# Altium schematic sheet Schematic_Scout2Map_Altium.schdoc
size 321 x 215 mm
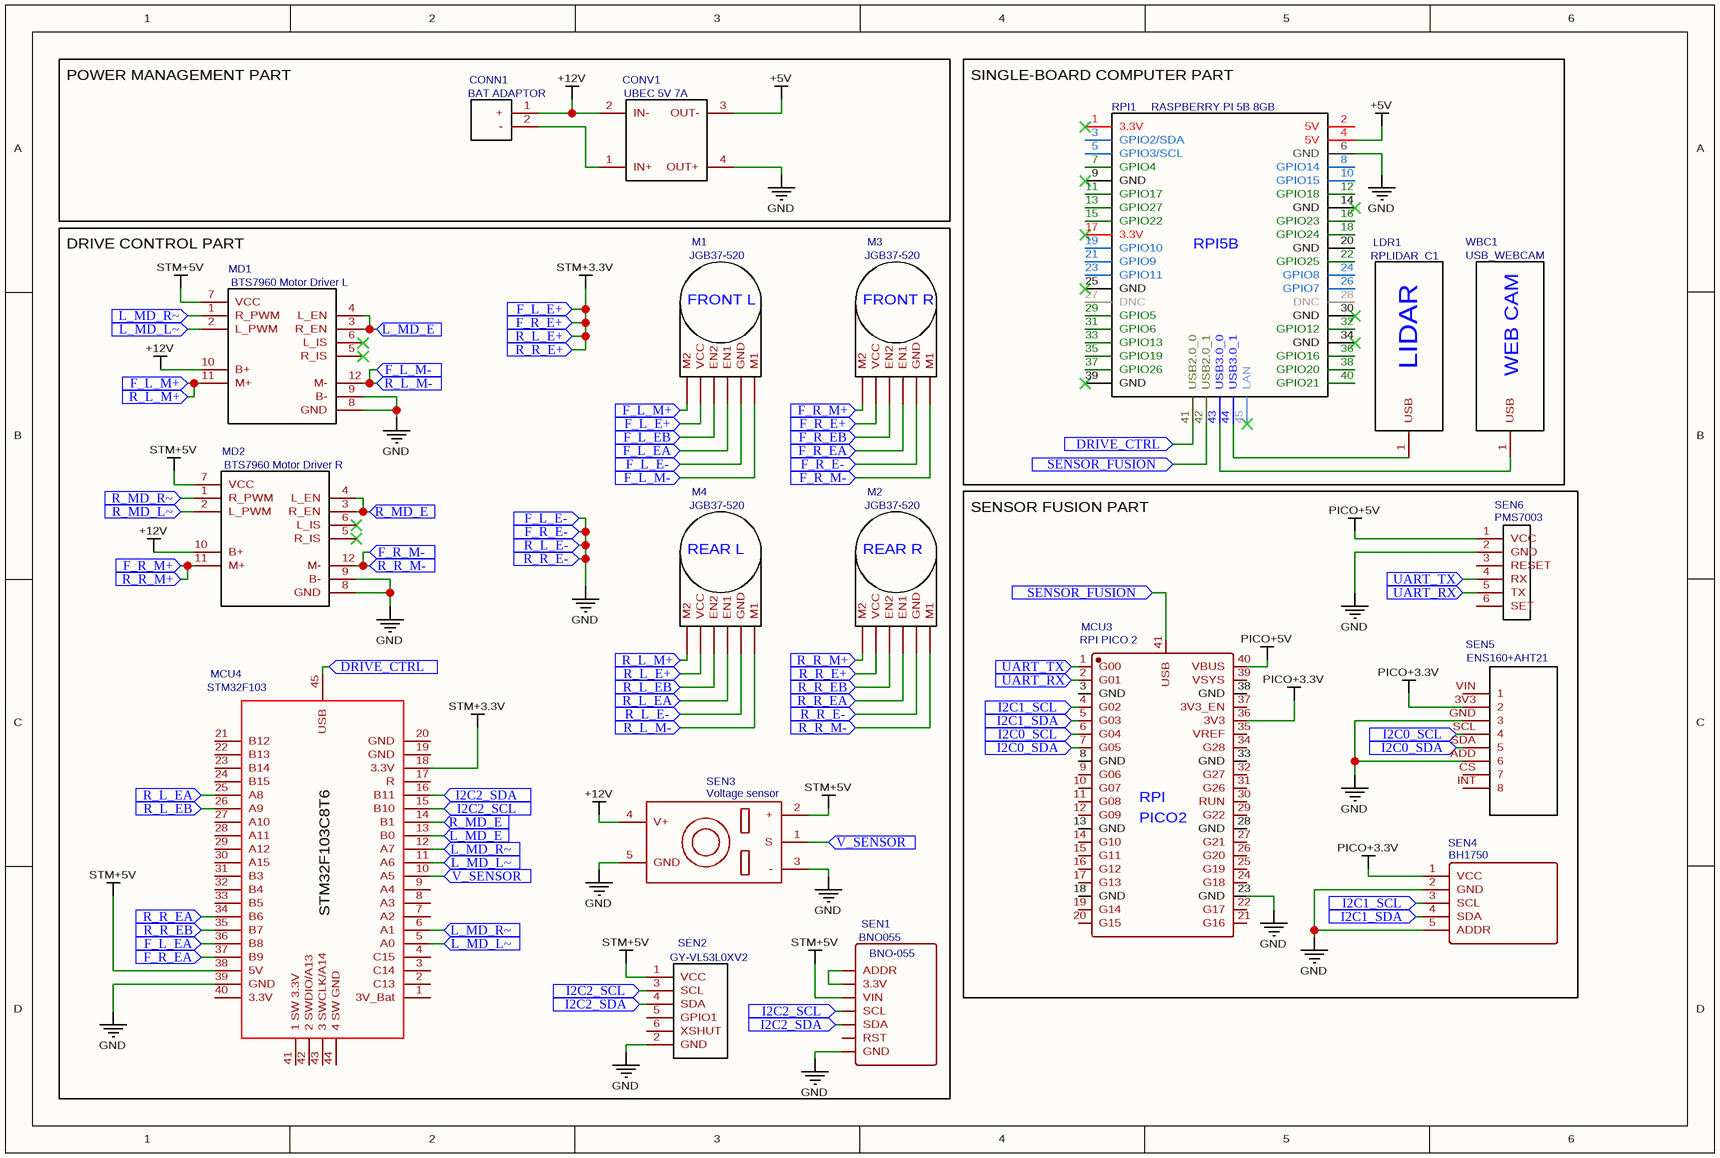
[diagram p0: Schematic_Scout2Map_Altium.schdoc]

## Parts
CONN1  BAT ADAPTOR  [AC ADAPTOR]
CONV1  UBEC 5V 7A  [STEPDOWN]
LDR1  RPLIDAR_C1  [TFMINI_LIDAR]
M1  JGB37-520  [N20_MOTOR_ENCODER_MOUNT]
M2  JGB37-520  [N20_MOTOR_ENCODER_MOUNT]
M3  JGB37-520  [N20_MOTOR_ENCODER_MOUNT]
M4  JGB37-520  [N20_MOTOR_ENCODER_MOUNT]
MCU3  RPI PICO 2  [RASPBERRYPI_PICO2]
MCU4  STM32F103  [STM32F103C8T6_NB]
MD1  BTS7960 Motor Driver L
MD2  BTS7960 Motor Driver R
RPI1  RASPBERRY PI 5B 8GB  [HDR-20X2/2.54]
SEN1  BNO055
SEN2  GY-VL53L0XV2
SEN3  Voltage sensor
SEN4  BH1750  [BH1750]
SEN5  ENS160+AHT21  [ENS160+AHT21]
SEN6  PMS7003  [PLANTOWER PMS7003]
WBC1  USB_WEBCAM  [TFMINI_LIDAR]

## Blocks framed on the sheet
POWER MANAGEMENT PART: CONN1 CONV1
SINGLE-BOARD COMPUTER PART: LDR1 RPI1 WBC1
DRIVE CONTROL PART: M1-M4 MCU4 MD1 MD2 SEN1-SEN3
SENSOR FUSION PART: MCU3 SEN4-SEN6

## Ports
DRIVE_CTRL (in), F_L_E+ (in), F_L_E- (in), F_L_EA (in), F_L_EB (in), F_L_M+ (in), F_L_M- (in), F_R_E+ (in), F_R_E- (in), F_R_EA (in), F_R_EB (in), F_R_M+ (in), F_R_M- (in), I2C0_SCL (in), I2C0_SDA (in), I2C1_SCL (in), I2C1_SDA (in), I2C2_SCL (in), I2C2_SDA (in), L_MD_E (in), L_MD_L~ (in), L_MD_R~ (in), R_L_E+ (in), R_L_E- (in), R_L_EA (in), R_L_EB (in), R_L_M+ (in), R_L_M- (in), R_MD_E (in), R_MD_L~ (in), R_MD_R~ (in), R_R_E+ (in), R_R_E- (in), R_R_EA (in), R_R_EB (in), R_R_M+ (in), R_R_M- (in), SENSOR_FUSION (in), UART_RX (in), UART_TX (in), V_SENSOR (in)

## Nets
+5V: CONV1.3(OUT-) RPI1.4(5V)
+12V: CONN1.1(+) CONV1.2(IN-) MD1.10(B+) MD2.10(B+) SEN3.4(V+)
GND: CONV1.4(OUT+) M1.2(GND) M2.2(GND) M3.2(GND) M4.2(GND) MCU3.23(GND) MCU4.39(GND) MD1.8(GND) MD1.9(B-) MD2.8(GND) MD2.9(B-) RPI1.6(GND) SEN1.3(GND) SEN2.2(GND) SEN3.3(-) SEN3.5(GND) SEN4.2(GND) SEN4.5(ADDR) SEN5.ADD(6) SEN5.GND(3) SEN6.2(GND) ; port F_L_E-, port F_R_E-, port R_R_E-, port R_L_E-
PICO+3.3V: MCU3.36(3V3) SEN4.1(VCC) SEN5.3V3(2)
PICO+5V: MCU3.40(VBUS) SEN6.1(VCC)
STM+3.3V: M1.5(VCC) M2.5(VCC) M3.5(VCC) M4.5(VCC) MCU4.18(3.3V) ; port F_L_E+, port F_R_E+, port R_R_E+, port R_L_E+
STM+5V: MCU4.38(5V) MD1.7(VCC) MD2.7(VCC) SEN1.1(VIN) SEN2.1(VCC) SEN3.2(+)
DRIVE_CTRL: MCU4.45(USB) RPI1.41(USB2.0_0) ; port DRIVE_CTRL
F_L_EA: M1.3(EN1) MCU4.36(B8) ; port F_L_EA
F_L_EB: M1.4(EN2) ; port F_L_EB
F_L_M+: M1.6(M2) M4.6(M2) MD1.11(M+) ; port F_L_M+, port R_L_M+
F_L_M-: M1.1(M1) M4.1(M1) MD1.12(M-) ; port F_L_M-, port R_L_M-
F_R_EA: M3.3(EN1) MCU4.37(B9) ; port F_R_EA
F_R_EB: M3.4(EN2) ; port F_R_EB
F_R_M+: M2.6(M2) M3.6(M2) MD2.11(M+) ; port F_R_M+, port R_R_M+
F_R_M-: M2.1(M1) M3.1(M1) MD2.12(M-) ; port F_R_M-, port R_R_M-
I2C0_SCL: MCU3.6(G04) SEN5.SCL(4) ; port I2C0_SCL
I2C0_SDA: MCU3.7(G05) SEN5.SDA(5) ; port I2C0_SDA
I2C1_SCL: MCU3.4(G02) SEN4.3(SCL) ; port I2C1_SCL
I2C1_SDA: MCU3.5(G03) SEN4.4(SDA) ; port I2C1_SDA
I2C2_SCL: MCU4.15(B10) SEN1.4(SCL) SEN2.3(SCL) ; port I2C2_SCL
I2C2_SDA: MCU4.16(B11) SEN1.5(SDA) SEN2.4(SDA) ; port I2C2_SDA
L_MD_E: MCU4.13(B0) MD1.3(R_EN) MD1.4(L_EN) ; port L_MD_E
L_MD_L~: MCU4.5(A0) MCU4.11(A6) MD1.2(L_PWM) ; port L_MD_L~
L_MD_R~: MCU4.6(A1) MCU4.12(A7) MD1.1(R_PWM) ; port L_MD_R~
R_L_EA: M4.3(EN1) MCU4.25(A8) ; port R_L_EA
R_L_EB: M4.4(EN2) MCU4.26(A9) ; port R_L_EB
R_MD_E: MCU4.14(B1) MD2.3(R_EN) MD2.4(L_EN) ; port R_MD_E
R_MD_L~: MD2.2(L_PWM) ; port R_MD_L~
R_MD_R~: MD2.1(R_PWM) ; port R_MD_R~
R_R_EA: M2.3(EN1) MCU4.34(B6) ; port R_R_EA
R_R_EB: M2.4(EN2) MCU4.35(B7) ; port R_R_EB
SENSOR_FUSION: MCU3.41(USB) RPI1.42(USB2.0_1) ; port SENSOR_FUSION
UART_RX: MCU3.2(G01) SEN6.5(TX) ; port UART_RX
UART_TX: MCU3.1(G00) SEN6.4(RX) ; port UART_TX
V_SENSOR: MCU4.10(A5) SEN3.1(S) ; port V_SENSOR
NetCONN1_2: CONN1.2(-) CONV1.1(IN+)
NetLDR1_1: LDR1.1(USB) RPI1.44(USB3.0_1)
NetRPI1_43: RPI1.43(USB3.0_0) WBC1.1(USB)
NetSEN1_2: SEN1.2(3.3V) SEN1.6(ADDR)

Not connected (* = marked no-connect by the designer): MCU3 3(GND) 8(GND) 9(G06) 10(G07) 11(G08) 12(G09) 13(GND) 14(G10) 15(G11) 16(G12) 17(G13) 18(GND) 19(G14) 20(G15) 21(G16) 22(G17) 24(G18) 25(G19) 26(G20) 27(G21) 28(GND) 29(G22) 30(RUN) 31(G26) 32(G27) 33(GND) 34(G28) 35(VREF) 37(3V3_EN) 38(GND) 39(VSYS); MCU4 1(3V_Bat) 2(C13) 3(C14) 4(C15) 7(A2) 8(A3) 9(A4) 17(R) 19(GND) 20(GND) 21(B12) 22(B13) 23(B14) 24(B15) 27(A10) 28(A11) 29(A12) 30(A15) 31(B3) 32(B4) 33(B5) 40(3.3V) 41(1_SW_3.3V) 42(2_SWDIO/A13) 43(3_SWCLK/A14) 44(4_SW_GND); MD1 5(R_IS)* 6(L_IS)*; MD2 5(R_IS)* 6(L_IS)*; RPI1 1(3.3V)* 2(5V) 3(GPIO2/SDA) 5(GPIO3/SCL) 7(GPIO4) 8(GPIO14) 9(GND)* 10(GPIO15) 11(GPIO17) 12(GPIO18) 13(GPIO27) 14(GND)* 15(GPIO22) 16(GPIO23) 17(3.3V)* 18(GPIO24) 19(GPIO10) 20(GND) 21(GPIO9) 22(GPIO25) 23(GPIO11) 24(GPIO8) 25(GND)* 26(GPIO7) 27(DNC) 28(DNC) 29(GPIO5) 30(GND)* 31(GPIO6) 32(GPIO12) 33(GPIO13) 34(GND)* 35(GPIO19) 36(GPIO16) 37(GPIO26) 38(GPIO20) 39(GND)* 40(GPIO21) 45(LAN)*; SEN1 7(RST); SEN2 5(GPIO1) 6(XSHUT); SEN5 CS(7) INT(8) VIN(1); SEN6 3(RESET) 6(SET)

## Notes on the sheet
- (in symbol BNO055) BNO-055
- (in symbol JGB37-520) FRONT L; FRONT R; REAR R; REAR L
- (in symbol RASPBERRY PI 5B 8GB) RPI5B
- (in symbol RPI PICO 2) RPI; PICO2
- (in symbol RPLIDAR_C1) LIDAR
- (in symbol USB_WEBCAM) WEB CAM

## Library data of the parts
CONN1 = BAT ADAPTOR: Contributor: odahmohammad361; spicePre: U; spiceSymbolName: Ac Adaptor
CONV1 = UBEC 5V 7A: Contributor: Nattanan; spicePre: U; spiceSymbolName: Stepdown
LDR1 = RPLIDAR_C1: Contributor: jihoonkimtech (Jihoon Kim); spicePre: U; spiceSymbolName: TFMini_Plus_Lidar
M1-M4 = JGB37-520: Contributor: preetpatel.svmr; spicePre: U; spiceSymbolName: N20_with_ENCODER
MCU3 = RPI PICO 2: Manufacturer: Raspberry Pi; Manufacturer Part: SC0918; Contributor: jihoonkimtech (Jihoon Kim); Supplier: Mouser; Supplier Part: 358-SC0918; spicePre: M; spiceSymbolName: RaspberryPi_Pico2 + USB
MCU4 = STM32F103: Manufacturer Part: STM32F103C8T6; Contributor: jihoonkimtech (Jihoon Kim); spicePre: U; spiceSymbolName: STM32F103C8T6 + USB
MD1 = BTS7960 Motor Driver L: Contributor: jihoonkimtech (Jihoon Kim); spicePre: U; spiceSymbolName: BST7960 Motor Drover
MD2 = BTS7960 Motor Driver R: Contributor: jihoonkimtech (Jihoon Kim); spicePre: U; spiceSymbolName: BST7960 Motor Drover
RPI1 = RASPBERRY PI 5B 8GB: Manufacturer Part: Raspberry Pi 4 Model B; Contributor: jihoonkimtech (Jihoon Kim); Manufacturer: Raspberry Pi; Supplier Part: 3775; link: https://www.raspberrypi.com/products/raspberry-pi-4-model-b/; spicePre: R; spiceSymbolName: RASPBERRY PI 4B + USB
SEN1 = BNO055: Contributor: jihoonkim.tech; spicePre: U; spiceSymbolName: BNO055
SEN2 = GY-VL53L0XV2: Contributor: jihoonkimtech (Jihoon Kim); spicePre: U; spiceSymbolName: GY-VL53L0XV2
SEN3 = Voltage sensor: Contributor: jihoonkimtech (Jihoon Kim); spicePre: U; spiceSymbolName: Voltage sensor
SEN4 = BH1750: Contributor: vinhdoan; spicePre: U; spiceSymbolName: BH1750
SEN5 = ENS160+AHT21: Contributor: yoduc; spicePre: U; spiceSymbolName: ENS160+AHT21
SEN6 = PMS7003: Contributor: pb158; spicePre: S; spiceSymbolName: Plantower PMS7003
WBC1 = USB_WEBCAM: Contributor: jihoonkimtech (Jihoon Kim); spicePre: U; spiceSymbolName: TFMini_Plus_Lidar